# EAGLE design Time Base Generator (EAGLE 7.5.0)
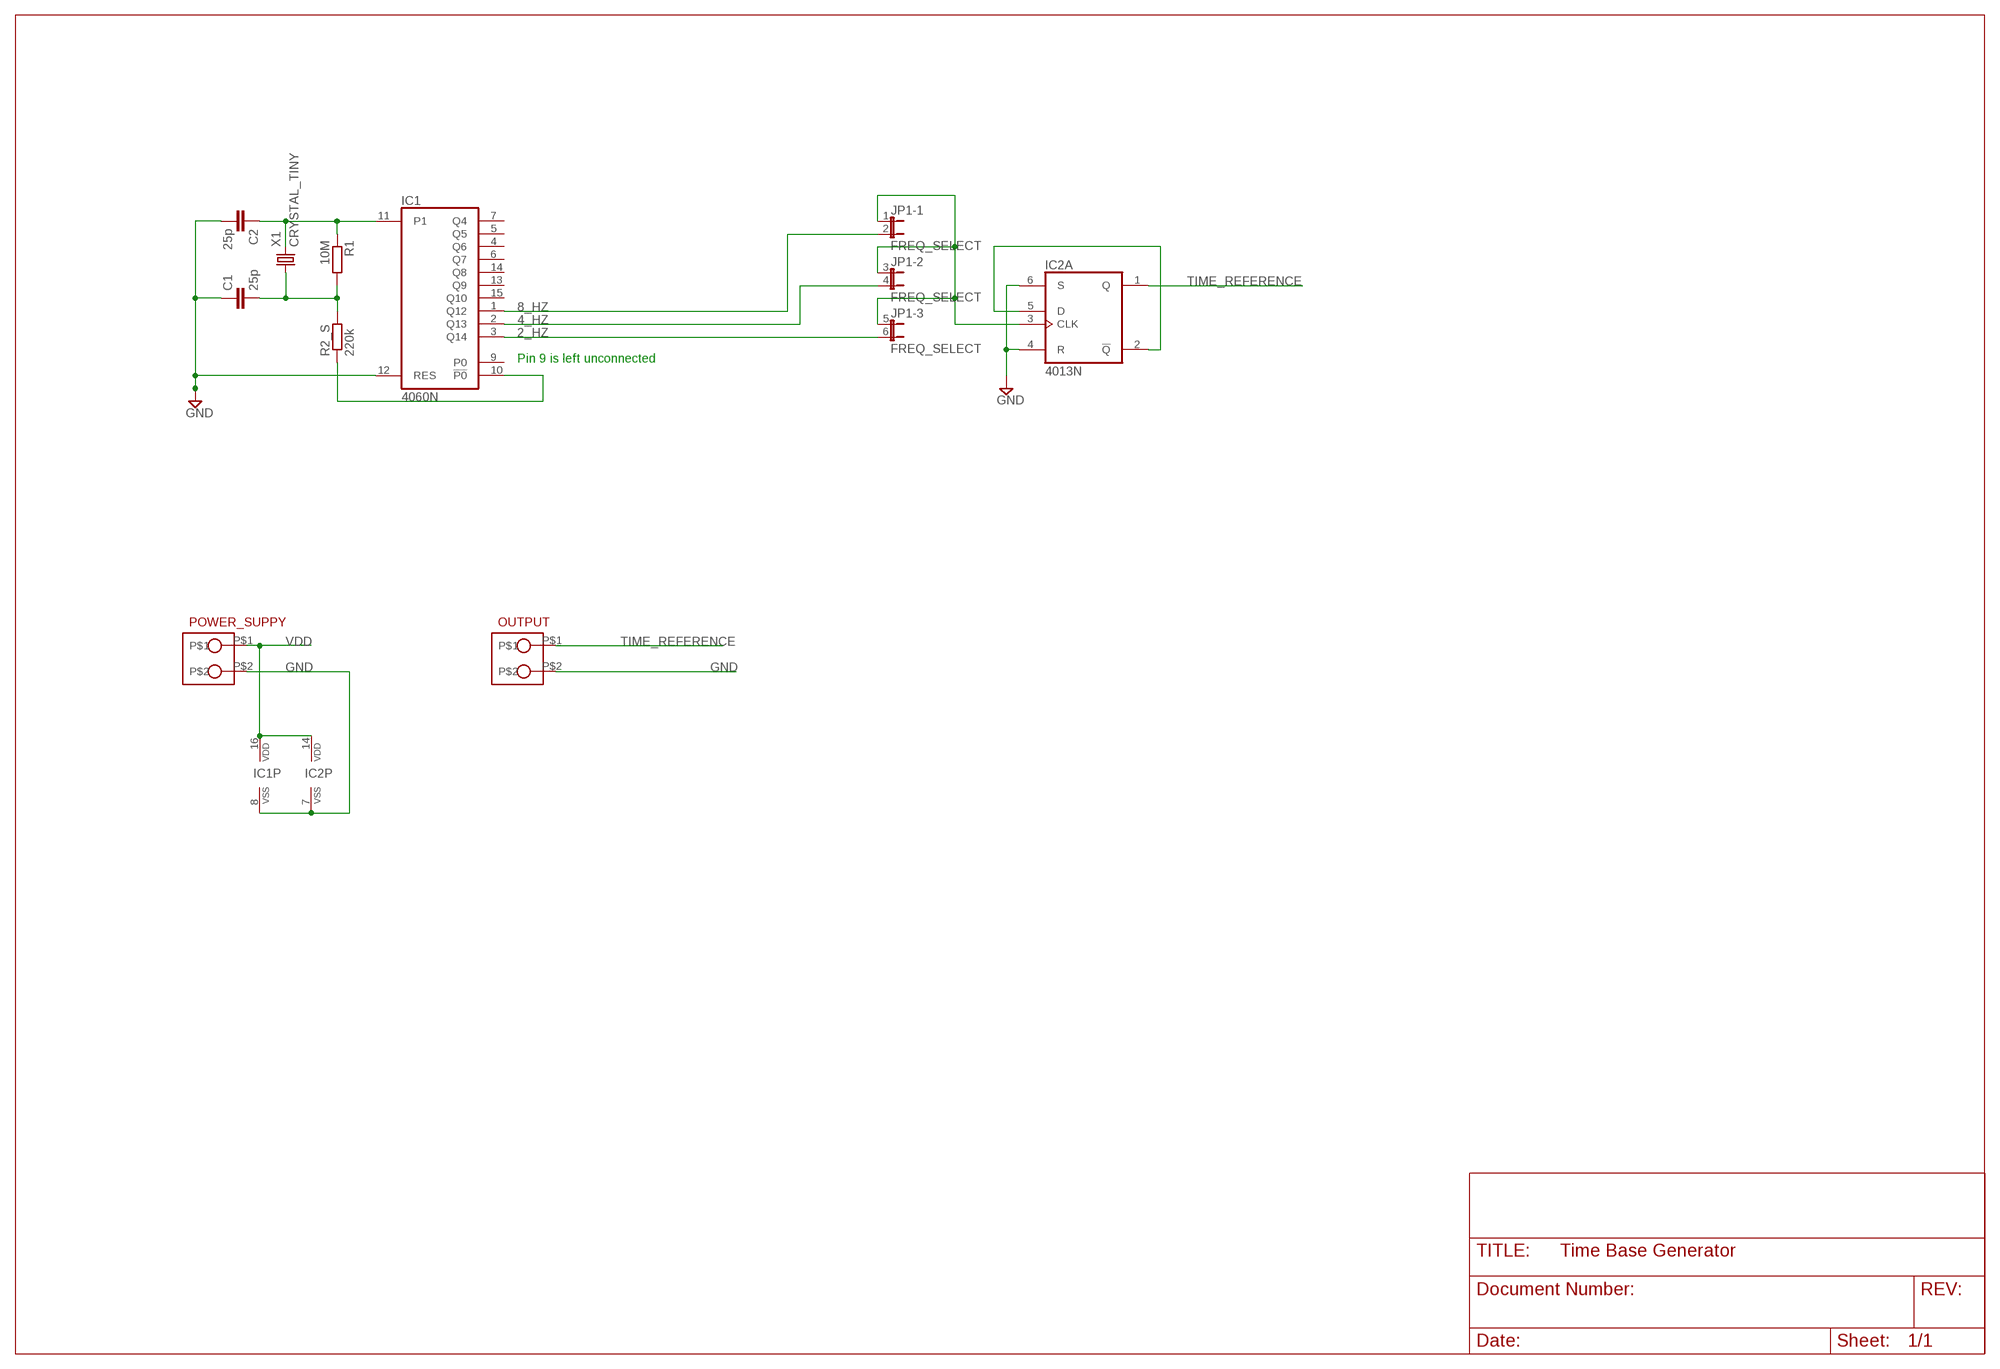
[diagram p0: schematic, sheet 1]

## Parts
C1  25p  C-EU050-025X075  [C050-025X075]
C2  25p  C-EU050-025X075  [C050-025X075]
IC1  4060N  [DIL16]
IC2  4013N  [DIL14]
JP1  FREQ_SELECT  JP3QE  [JP3Q]
OUTPUT  CON_2_SIL  [SIL_2_0.2INCH]
POWER_SUPPY  CON_2_SIL  [SIL_2_0.2INCH]
R1  10M  R-EU_0207/10  [0207/10]
R2_S  220k  R-EU_0207/10  [0207/10]
X1  CRYSTAL_TINY  [WATCH-3X8-SPACED]

## Nets
2_HZ: IC1.3(Q14) JP1.6
4_HZ: IC1.2(Q13) JP1.4
8_HZ: IC1.1(Q12) JP1.2
GND: C1.1 C2.2 IC1.8(VSS) IC1.12(RES) IC2.4(A:R) IC2.6(A:S) IC2.7(P:VSS) OUTPUT.P$2 POWER_SUPPY.P$2
N$1: C2.1 IC1.11(P1) R1.1 X1.2
N$2: C1.2 R1.2 R2_S.2 X1.1
N$3: IC1.10(!P0) R2_S.1
N$5: IC2.2(A:!Q) IC2.5(A:D)
N$8: IC2.3(A:CLK) JP1.1 JP1.3 JP1.5
TIME_REFERENCE: IC2.1(A:Q) OUTPUT.P$1
VDD: IC1.16(VDD) IC2.14(P:VDD) POWER_SUPPY.P$1
Unconnected: IC1.4(Q6) IC1.5(Q5) IC1.6(Q7) IC1.7(Q4) IC1.9(P0) IC1.13(Q9) IC1.14(Q8) IC1.15(Q10) IC2.8(B:S) IC2.9(B:D) IC2.10(B:R) IC2.11(B:CLK) IC2.12(B:!Q) IC2.13(B:Q)

## Notes on the sheet
- Pin 9 is left unconnected

## Library data of the parts
C1 C2 = resistor:C-EU: CAPACITOR, European symbol
IC1 = 40xx:4060: 14-stage binary/ripple COUNTER
IC2 = 40xx:4013: Dual D FLIP FLOP, set/reset
JP1 = jumper:JP3QE: JUMPER
OUTPUT POWER_SUPPY = PGT:CON_2_SIL: Connecteur à 2 pattes, avec un écart de 0.2 inc (soit 5.08 mm).
R1 R2_S = resistor:R-EU_: RESISTOR, European symbol
X1 = PGT:CRYSTAL_TINY: This a CRYSTALS-NOGND-WATCH-3X8 with more space between pads

## Board
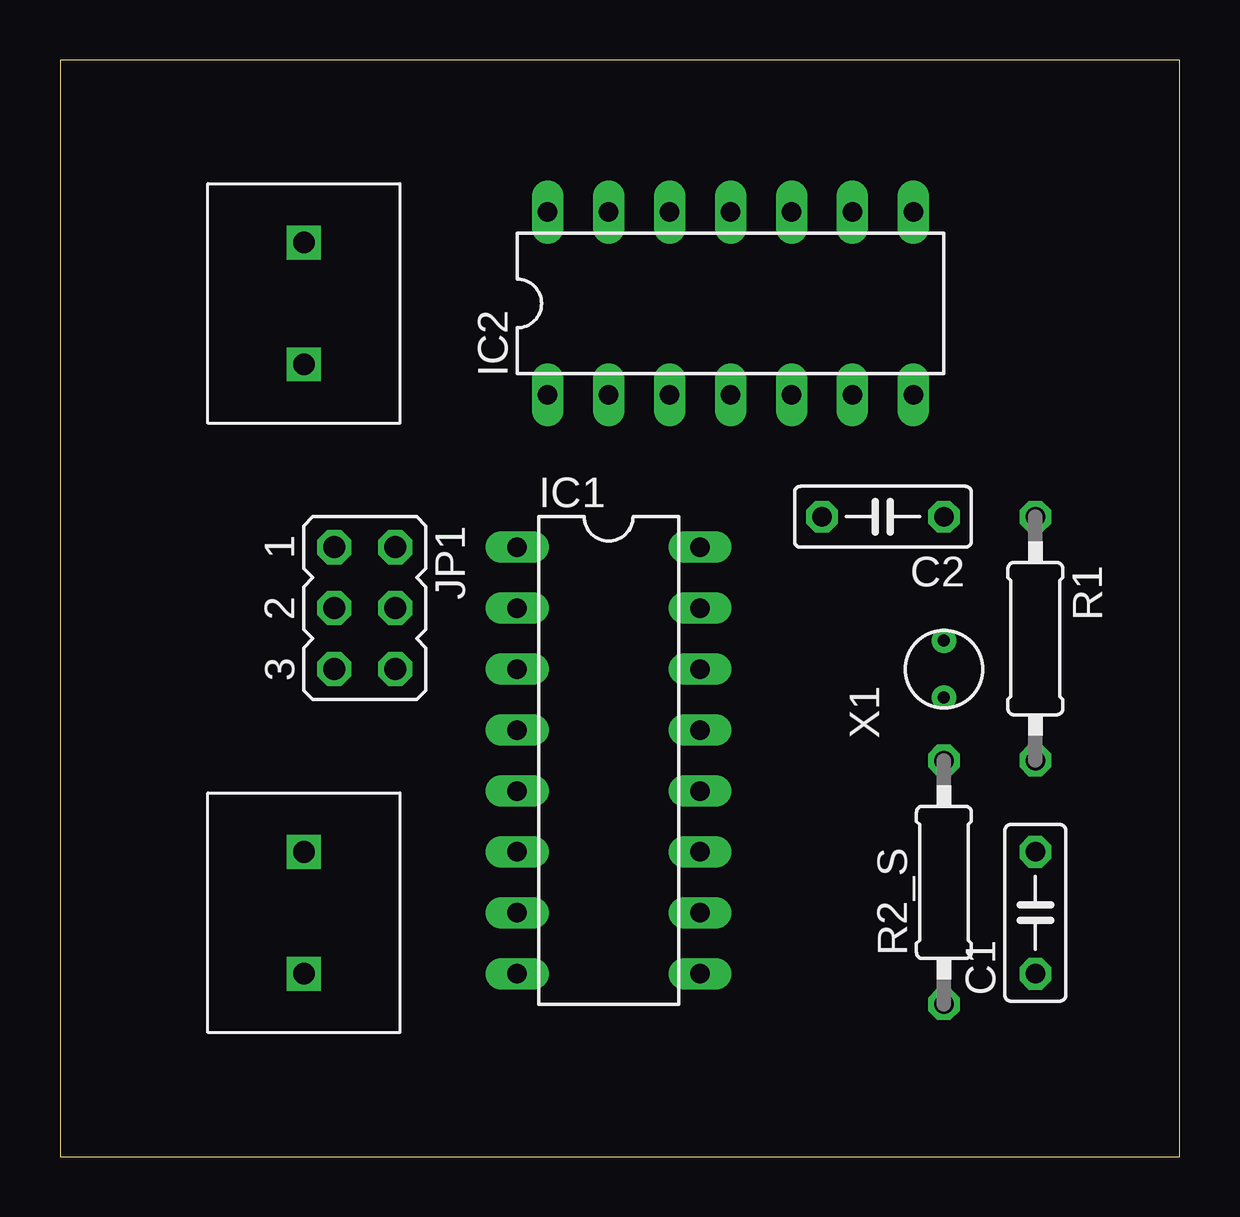
[diagram p1: board, top side]
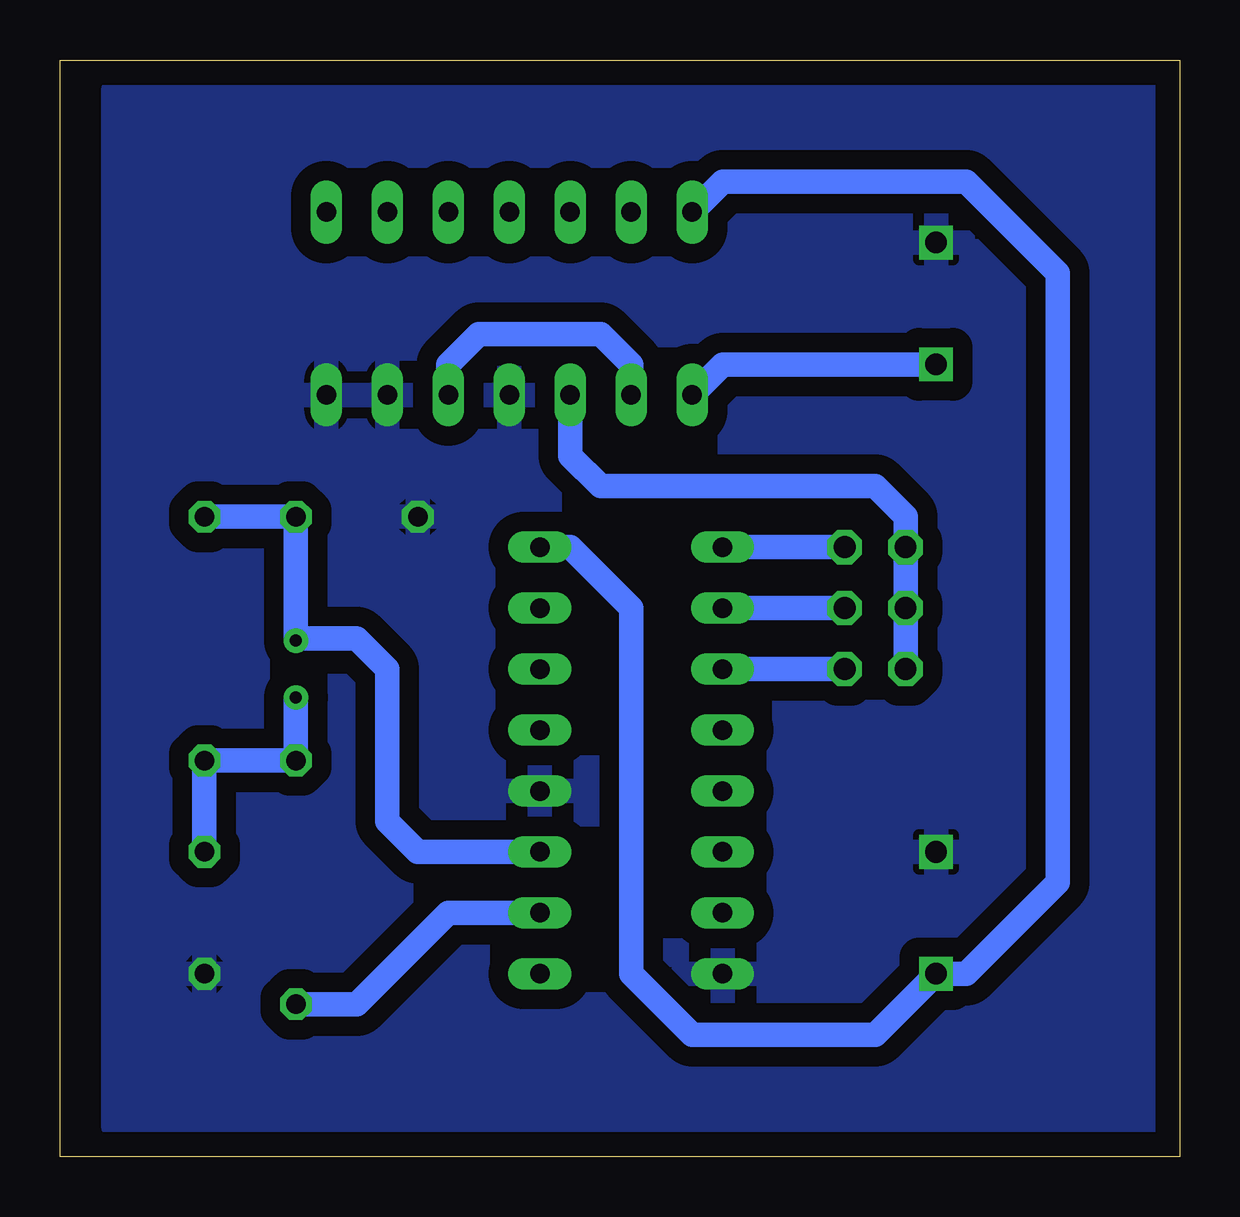
[diagram p2: board, bottom side, seen from below]

Size 46.66 x 45.71 mm. Coordinates in mm from the lower left corner, seen from the top.
Outline: 0,0 46.66,0 46.66,45.71 0,45.71 0,0
Copper layers (1*16): Top 0.035mm / dielectric 1.5mm / Bottom 0.035mm
Design rules "default *": minimum track width 10mil, minimum drill 24mil, track to track 8mil, track to pad 8mil, pad to pad 8mil, via to via 8mil, smd to smd 8mil, copper to edge 40mil, drill to drill 8mil, minimum pad ring 10mil, minimum via ring 8mil, stop-mask expansion 4mil, vias tented up to drill 0mil, thermal gap 10mil

### Footprints (pad centres in the part's own frame; a part is rotated, then mirrored left to right if it is on the bottom)
C050-025X075 = drill 0.813 octagon: 1 -2.54,0; 2 2.54,0
DIL16 = drill 0.813 long: 1 -8.89,-3.81; 2 -6.35,-3.81; 3 -3.81,-3.81; 4 -1.27,-3.81; 5 1.27,-3.81; 6 3.81,-3.81; 7 6.35,-3.81; 8 8.89,-3.81; 9 8.89,3.81; 10 6.35,3.81; 11 3.81,3.81; 12 1.27,3.81; 13 -1.27,3.81; 14 -3.81,3.81; 15 -6.35,3.81; 16 -8.89,3.81
DIL14 = drill 0.813 long: 1 -7.62,-3.81; 2 -5.08,-3.81; 3 -2.54,-3.81; 4 0,-3.81; 5 2.54,-3.81; 6 5.08,-3.81; 7 7.62,-3.81; 8 7.62,3.81; 9 5.08,3.81; 10 2.54,3.81; 11 0,3.81; 12 -2.54,3.81; 13 -5.08,3.81; 14 -7.62,3.81
JP3Q = drill 0.914 octagon: 1 -2.54,-1.27; 2 -2.54,1.27; 3 0,-1.27; 4 0,1.27; 5 2.54,-1.27; 6 2.54,1.27
SIL_2_0.2INCH = drill 0.9 square: P$1 0,2.54; P$2 0,-2.54
0207/10 = drill 0.813 octagon: 1 -5.08,0; 2 5.08,0
WATCH-3X8-SPACED = drill 0.5 pad 0.9: 1 -1.185,0; 2 1.185,0

### Placement (x,y rotation side)
C1  40.64,10.16 90 top
C2  34.29,26.67 180 top
IC1  22.86,16.51 270 top
IC2  27.94,35.56 0 top
JP1  12.7,22.86 270 top
OUTPUT  10.16,35.56 180 top
POWER_SUPPY  10.16,10.16 180 top
R1  40.64,21.59 270 top
R2_S  36.83,11.43 90 top
X1  36.83,20.32 90 top

### Tracks (layer width: path | path; a pad name or v marks a point on that pad's centre or on a via)
2_HZ
  Bottom 1.016: IC1.3 JP1.6
4_HZ
  Bottom 1.016: IC1.2 JP1.4
8_HZ
  Bottom 1.016: IC1.1 JP1.2
GND
  pour Bottom (isolate 0.813): 1.27,44.45 1.27,1.27 44.45,1.27 44.45,44.45
N$1
  Bottom 1.016: R1.1 C2.1 X1.2 36.74,21.59 34.29,21.59 33.02,20.32 33.02,13.97 31.75,12.7 IC1.11
N$2
  Bottom 1.016: C1.2 R1.2 R2_S.2 X1.1
N$3
  Bottom 1.016: IC1.10 30.48,10.16 34.29,6.35 R2_S.1
N$5
  Bottom 1.016: IC2.2 22.86,33.02 24.13,34.29 29.21,34.29 30.48,33.02 IC2.5
N$8
  Bottom 1.016: JP1.5 JP1.3 JP1.1 11.43,26.67 12.7,27.94 24.13,27.94 25.4,29.21 IC2.3
TIME_REFERENCE
  Bottom 1.016: OUTPUT.P$1 19.05,33.02 IC2.1
VDD
  Bottom 1.016: IC1.16 25.4,25.4 22.86,22.86 22.86,7.62 20.32,5.08 12.7,5.08 POWER_SUPPY.P$1 8.89,7.62 5.08,11.43 5.08,36.83 8.89,40.64 19.05,40.64 IC2.14